# Altium schematic sheet WideRangeVoltmeter.SchDoc
size A4; SheetNumber: 8; SheetTotal: 8
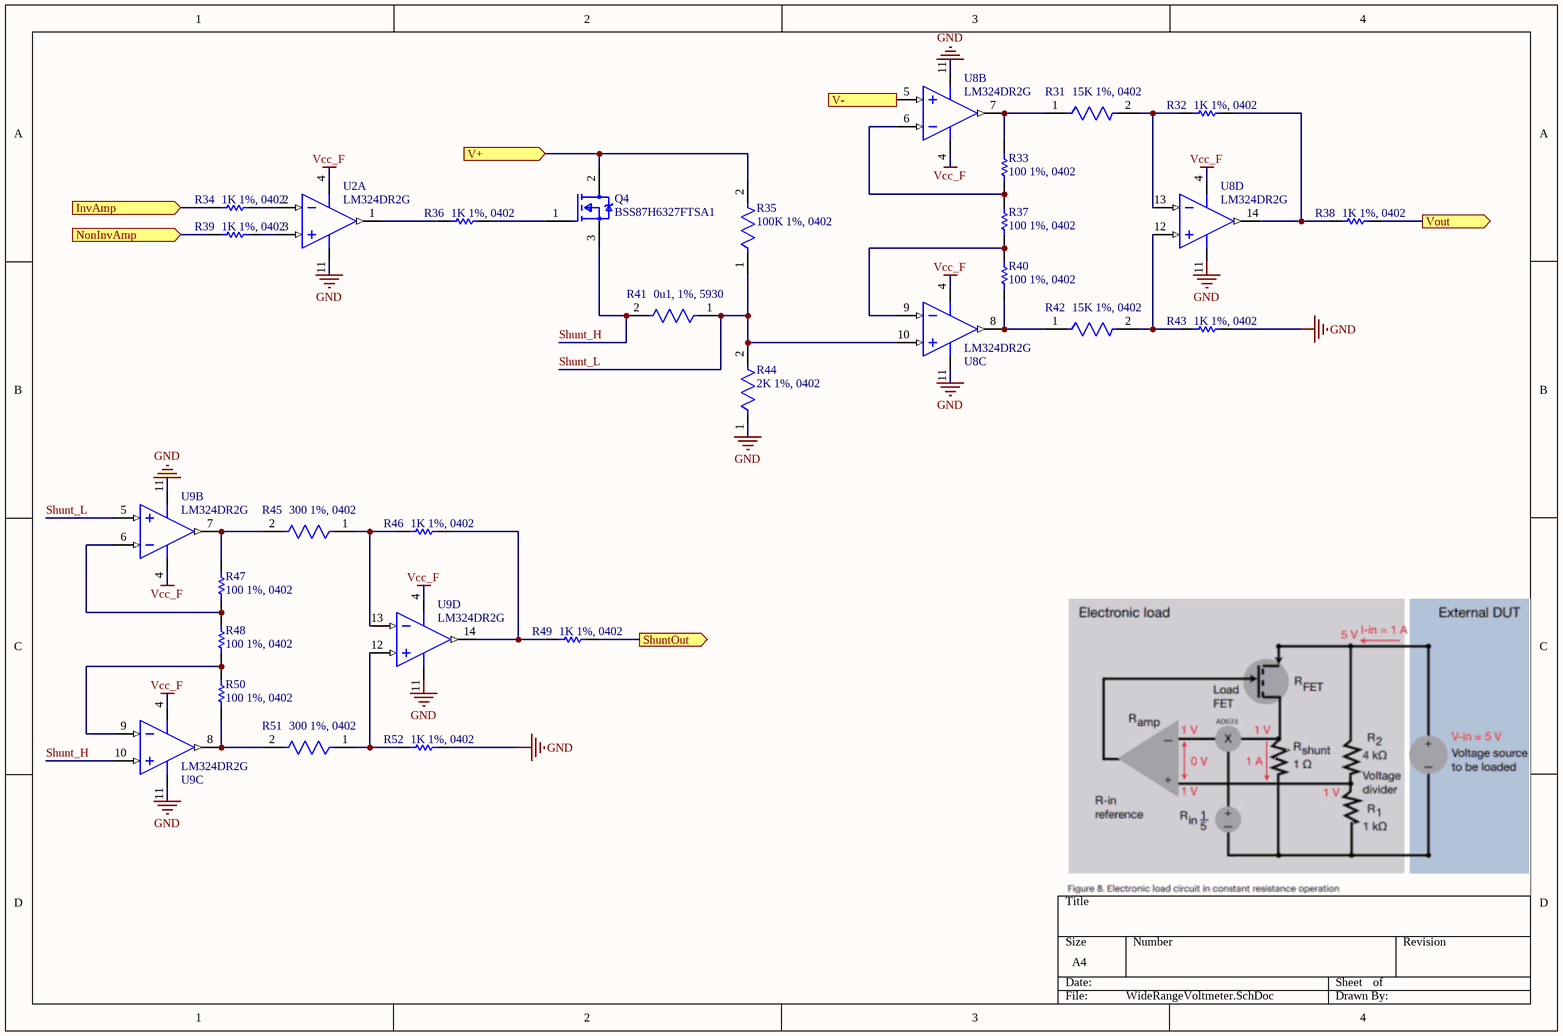
[diagram p0: WideRangeVoltmeter.SchDoc]

## Parts
Q4  BSS87H6327FTSA1  [FP-PG-SOT89-4-MFG]
R31  15K 1%, 0402  [FP-ERJ2R-MFG]
R32  1K 1%, 0402  [RESC1005X40X25NL05T05]
R33  100 1%, 0402  [RESC1005X40X25LL05T05]
R34  1K 1%, 0402  [RESC1005X40X25NL05T05]
R35  100K 1%, 0402  [FP-ERJ2RK-IPC_C]
R36  1K 1%, 0402  [RESC1005X40X25NL05T05]
R37  100 1%, 0402  [RESC1005X40X25LL05T05]
R38  1K 1%, 0402  [RESC1005X40X25NL05T05]
R39  1K 1%, 0402  [RESC1005X40X25NL05T05]
R40  100 1%, 0402  [RESC1005X40X25LL05T05]
R41  0u1, 1%, 5930  [FP-CSS2H-5930K-1L00F-MFG]
R42  15K 1%, 0402  [FP-ERJ2R-MFG]
R43  1K 1%, 0402  [RESC1005X40X25NL05T05]
R44  2K 1%, 0402  [FP-ERJ2RK-MFG]
R45  300 1%, 0402  [FP-ERJ2RK-IPC_A]
R46  1K 1%, 0402  [RESC1005X40X25NL05T05]
R47  100 1%, 0402  [RESC1005X40X25LL05T05]
R48  100 1%, 0402  [RESC1005X40X25LL05T05]
R49  1K 1%, 0402  [RESC1005X40X25NL05T05]
R50  100 1%, 0402  [RESC1005X40X25LL05T05]
R51  300 1%, 0402  [FP-ERJ2RK-IPC_A]
R52  1K 1%, 0402  [RESC1005X40X25NL05T05]
U2  LM324DR2G  [ONSC-SOIC-14-751A-03_V]  (part A of 4)
U8  LM324DR2G  [ONSC-SOIC-14-751A-03_V]  (parts B,C,D of 4)
U9  LM324DR2G  [ONSC-SOIC-14-751A-03_V]  (parts B,C,D of 4)

## Ports
InvAmp (in, see MainBoard[2A], CellVoltageControl[1C]), NonInvAmp (in, see MainBoard[2A], CellVoltageControl[1C]), ShuntOut (out), V+ (in, see MainBoard[3A]), V- (in, see MainBoard[3A]), Vout (out, see MainBoard[3A], CellVoltageControl[2B])

## Nets
GND: R43.2 R44.1 R52.2 U2.11(VEE/GND) U8.11(VEE/GND) U9.11(VEE/GND)
Vcc_F: U2.4(VCC) U8.4(VCC) U9.4(VCC)
InvAmp: R34.1 ; port InvAmp
NonInvAmp: R39.1 ; port NonInvAmp
Shunt_H: Q4.3(Source) R41.2 U9.10(IN3+)
Shunt_L: R35.1 R41.1 R44.2 U8.10(IN3+) U9.5(IN2+)
ShuntOut: R49.2 ; port ShuntOut
V+: Q4.2(Drain) R35.2 ; port V+
V-: U8.5(IN2+) ; port V-
Vout: R38.2 ; port Vout
NetQ4_1: Q4.1(Gate) R36.2
NetR31_1: R31.1 R33.2 U8.7(OUT2)
NetR31_2: R31.2 R32.1 U8.13(IN4-)
NetR32_2: R32.2 R38.1 U8.14(OUT4)
NetR33_1: R33.1 R37.2 U8.6(IN2-)
NetR34_2: R34.2 U2.2(IN1-)
NetR36_1: R36.1 U2.1(OUT1)
NetR37_1: R37.1 R40.2 U8.9(IN3-)
NetR39_2: R39.2 U2.3(IN1+)
NetR40_1: R40.1 R42.1 U8.8(OUT3)
NetR42_2: R42.2 R43.1 U8.12(IN4+)
NetR45_1: R45.1 R46.1 U9.13(IN4-)
NetR45_2: R45.2 R47.2 U9.7(OUT2)
NetR46_2: R46.2 R49.1 U9.14(OUT4)
NetR47_1: R47.1 R48.2 U9.6(IN2-)
NetR48_1: R48.1 R50.2 U9.9(IN3-)
NetR50_1: R50.1 R51.2 U9.8(OUT3)
NetR51_1: R51.1 R52.1 U9.12(IN4+)

## Notes on the sheet
- Labels drawn without touching a wire or pin: GND

## Library data of the parts
Q4 = CMP-32901-001322-1: MOSFET N-CH 240V 260MA SOT89-4; Input Capacitance: 97pF; Drain to Source Resistance: 3.9R; Rise Time: 3.5ns; Rds On Max: 6R; Fall Time: 27.3ns; Turn-On Delay Time: 3.7ns; Number of Elements: 1; Power Dissipation: 1W; Element Configuration: Single; Gate to Source Voltage (Vgs): 20V; Polarity: N-CHANNEL; Turn-Off Delay Time: 17.6ns; Case/Package: SOT-89; Max Dual Supply Voltage: 240V; Drain to Source Voltage (Vdss): 240V; Lead Free: Lead Free; Package Quantity: 1000; Halogen Free: Not Halogen Free; RoHS Compliant: Yes; Width: 2.5mm; Length: 4.5mm; Mount: Surface Mount; Packaging: Tape and Reel; Max Power Dissipation: 1W; Height: 1.5mm; Max Operating Temperature: 150°C; Series: SIPMOS®; Drain to Source Breakdown Voltage: 240V; Min Operating Temperature: -55°C; Number of Pins: 3; Continuous Drain Current (ID): 260mA
R31 R42 = CMP-2002-00694-4: RES SMD 15K OHM 1% 1/10W 0402; Manufacturer Part Number: ERJ-2RKF1502X; Manufacturer: Panasonic; Automotive Grade: Grade 0; Voltage Rating: 50V; Resistance: 15kΩ; Temperature Coefficient: 100ppm/°C; Power Rating: 0.1W; Value: 15kΩ; ComponentLink2URL: https://industrial.panasonic.com/cdbs/www-data/pdf/RDA0000/AOA0000C304.pdf; Automotive: Yes; Temperature: -55°C to +155°C; Height: 0.4mm; Digikey Description: RES SMD 15K OHM 1% 1/10W 0402; Category: Res; Device Class L2: Resistors; Device Class L1: Passive Components; Package: ERJ2R; Temperature Range Low: -55°C; Tolerance: 1%; Series: ERJ; Footprint Url: https://b2b-api.panasonic.eu/file_stream/pids/fileversion/1180; Mouser Description: Res Thick Film 1.0 x 0.5 mm 15K Ohm 1% 0.1W(1/10W) 100ppm/ C Molded SMD Punched Carrier T/R; Composition: Thick Film; Lead Free: Yes; Device Class L3: Chip SMD Resistors; Octopart: https://octopart.com/erj-2rkf1502x-panasonic-55404985; RoHS: TRUE; Temperature Range High: +155°C; ComponentLink2Description: Datasheet
R32 R34 R36 R38 R39 R43 R46 R49 R52 = CMP-1011-00510-4: Chip Resistor, 1 KOhm, +/- 1%, 100 mW, -55 to 155 degC, 0402 (1005 Metric), RoHS, Tape and Reel; PartNumber: ERJ-2RKF1001X; Manufacturer: Basic Passives; Voltage Rating: 50 V; Case\/Package: 0402; Resistance: 1 KOhm; Power Rating: 100 mW; DatasheetVersion: 04/2015; Radiation Hardening: No; Pins: 2; Height: 0.35 mm; RoHSCompliant: true; Case Code (Imperial): 0402; ComponentLink2Description: Datasheet; ComponentLink1Description: Manufacturer URL; PackageReference: 0402; Mount: Surface Mount; Package Quantity: 10000; Tolerance: 1%; ComponentLink1URL: http://www.panasonic.com/; PackageDescription: 2-Pin Surface Mount Device, Body 1 x 0.5 mm; Mounting Technology: Surface Mount; Case Code (Metric): 1005; ComponentLink2URL: http://industrial.panasonic.com/cdbs/www-data/pdf/RDA0000/AOA0000C86.pdf; REACH SVHC: Yes; Packaging: Tape and Reel; Max Operating Temperature: 155 degC; Min Operating Temperature: -55 degC; Width: 0.5 mm; Length: 1 mm
R33 R37 R40 R47 R48 R50 = CMP-2002-00605-3: Chip Resistor, 100 Ohm, +/- 1%, 100 mW, -55 to 155 degC, 0402 (1005 Metric), RoHS, Tape and Reel; Manufacturer: Basic Passives; PartNumber: ERJ-2RKF1000X; Power Rating: 100 mW; Resistance: 100 Ohm; Voltage Rating: 50 V; Case\/Package: 0402; Width: 0.5 mm; Pins: 2; ComponentLink2Description: Datasheet; PackageReference: 0402; Height: 0.35 mm; Tolerance: 1%; DatasheetVersion: 04/2015; Case Code (Imperial): 0402; Min Operating Temperature: -55 degC; Radiation Hardening: No; Length: 1 mm; Package Quantity: 10000; PackageDescription: 2-Pin Surface Mount Device, Body 1 x 0.5 mm; Mounting Technology: Surface Mount; Case Code (Metric): 1005; Packaging: Tape and Reel; ComponentLink1URL: http://www.panasonic.com/; RoHSCompliant: true; Max Operating Temperature: 155 degC; REACH SVHC: Yes; ComponentLink1Description: Manufacturer URL; ComponentLink2URL: http://industrial.panasonic.com/cdbs/www-data/pdf/RDA0000/AOA0000C86.pdf; Mount: Surface Mount
R35 = CMP-2002-00608-4: RES SMD 100K OHM 1% 1/10W 0402; Resistance: 100kR; Voltage Rating (DC): 50V; Power Rating: 100mW; Temperature Coefficient: 100ppm/°C; Case/Package: 0402; Length: 1mm; Package Quantity: 1; Radiation Hardening: No; Case Code (Metric): 1005; Contact Plating: Tin; Mount: Surface Mount; Depth: 0.5mm; Max Operating Temperature: 155°C; Lead Free: Lead Free; Width: 0.5mm; Composition: Thick Film; Case Code (Imperial): 0402; Tolerance: 1%; Termination: SMD/SMT; Number of Pins: 2; Height: 0.35mm; Voltage Rating: 50V; Military Standard: Not; REACH SVHC: No SVHC; Packaging: Tape and Reel; Min Operating Temperature: -55°C; Max Power Dissipation: 100mW; Features: Automotive AEC-Q200; Number of Terminations: 2
R41 = CMP-00059-73869598-1: CSS2H-5930K-1L00F Res Metal Strip 5930 0.001 Ohm 1% 9W ±50ppm/C Pad SMD Automotive T/R; Resistance: 1mΩ; Temperature Coefficient: 50ppm/°C; Case Code (Imperial): 5931; Width: 7.747mm; Min Operating Temperature: -55°C; Tolerance: 1%; Max Power Dissipation: 9W; Case Code (Metric): 1577; Max Operating Temperature: 170°C; NexarPartId: 73869598; Power Rating: 9W; Composition: Metal Element; Case/Package: 5930; Height: 939.8µm; Number of Terminations: 2; Schedule B: 8533210045, 8533210045; Packaging: Cut Tape; REACH SVHC: No SVHC; Features: Moisture Resistant; RoHS: Compliant; Length: 15.0114mm
R44 = CMP-2002-00758-4: RES SMD 2K OHM 1% 1/10W 0402; Temperature Coefficient: 100ppm/°C; Max Power Dissipation: 100mW; Working Voltage: 50V; Resistance: 2kR; Number of Terminations: 2; Technology: THICK FILM; Packaging: Tape and Reel; RoHS Compliant: Yes; Min Operating Temperature: -55°C; Length: 1mm; Construction: Rectangular; Features: Automotive AEC-Q200; Contact Plating: Tin; Lead Free: Lead Free; Series: ERJ; Power Rating: 100mW; REACH SVHC: No SVHC; Resistor Type: Thick Film; Max Operating Temperature: 155°C; Package Quantity: 10000; Height: 0.35mm; Case/Package: 0402; Tolerance: 1%; Mount: Surface Mount; Termination: SMD/SMT; Resistance Tolerance: 1%; Depth: 0.5mm; Voltage Rating (DC): 50V; Voltage Rating: 50V; Case Code (Imperial): 0402; Military Standard: Not; Width: 0.02inch; Radiation Hardening: No; Case Code (Metric): 1005
R45 R51 = CMP-1011-00449-3: RES SMD 300 OHM 1% 1/10W 0402; Power Rating: 100mW; Voltage Rating: 50V; Temperature Coefficient: 100ppm/°C; Resistance: 300R; Case Code (Imperial): 0402; Termination: SMD/SMT; REACH SVHC: No SVHC; Number of Terminations: 2; Composition: Thick Film; Case Code (Metric): 1005; Voltage Rating (DC): 50V; Packaging: Tape and Reel; Max Power Dissipation: 100mW; Tolerance: 1%; Lead Free: Lead Free; Military Standard: Not; Mount: Surface Mount; Height: 0.35mm; Package Quantity: 10000; Max Operating Temperature: 155°C; Depth: 0.5mm; Min Operating Temperature: -55°C; Length: 1mm; Contact Plating: Tin; Width: 0.02inch; Case/Package: 0402
U2 U8 U9 = CMP-1310-00171-1: Single Supply Quad Operational Amplifier, 3 to 32 V, 0 to 70 degC, 14-Pin SOIC, Pb-Free, Tape and Reel; Manufacturer: On Semiconductor; VCC Max (V): 32; VCC Min (V): 3; PackageVersion: Rev. K, 05/2011; ComponentLink3URL: http://www.onsemi.com/pub_link/Collateral/751A-03.PDF; ComponentLink3Description: Package Specification; Packing: Tape and Reel; ComponentLink2URL: http://www.onsemi.cn/pub_link/Collateral/LM324-D.PDF; PackageReference: SOIC-14-751A-03; ComponentLink1URL: http://www.onsemi.com/; PackageDescription: 14-Pin Small Outline Integrated Circuit, Body 8.65 x 3.9 mm, Pitch 1.27 mm; ComponentLink1Description: Manufacturer URL; DatasheetVersion: Rev. 25; Mounting Technology: Surface Mount; RoHS: TRUE; ComponentLink2Description: Datasheet; PartNumber: LM324DR2G